# EAGLE design control-zenerbridge2 (EAGLE 6.6.0)
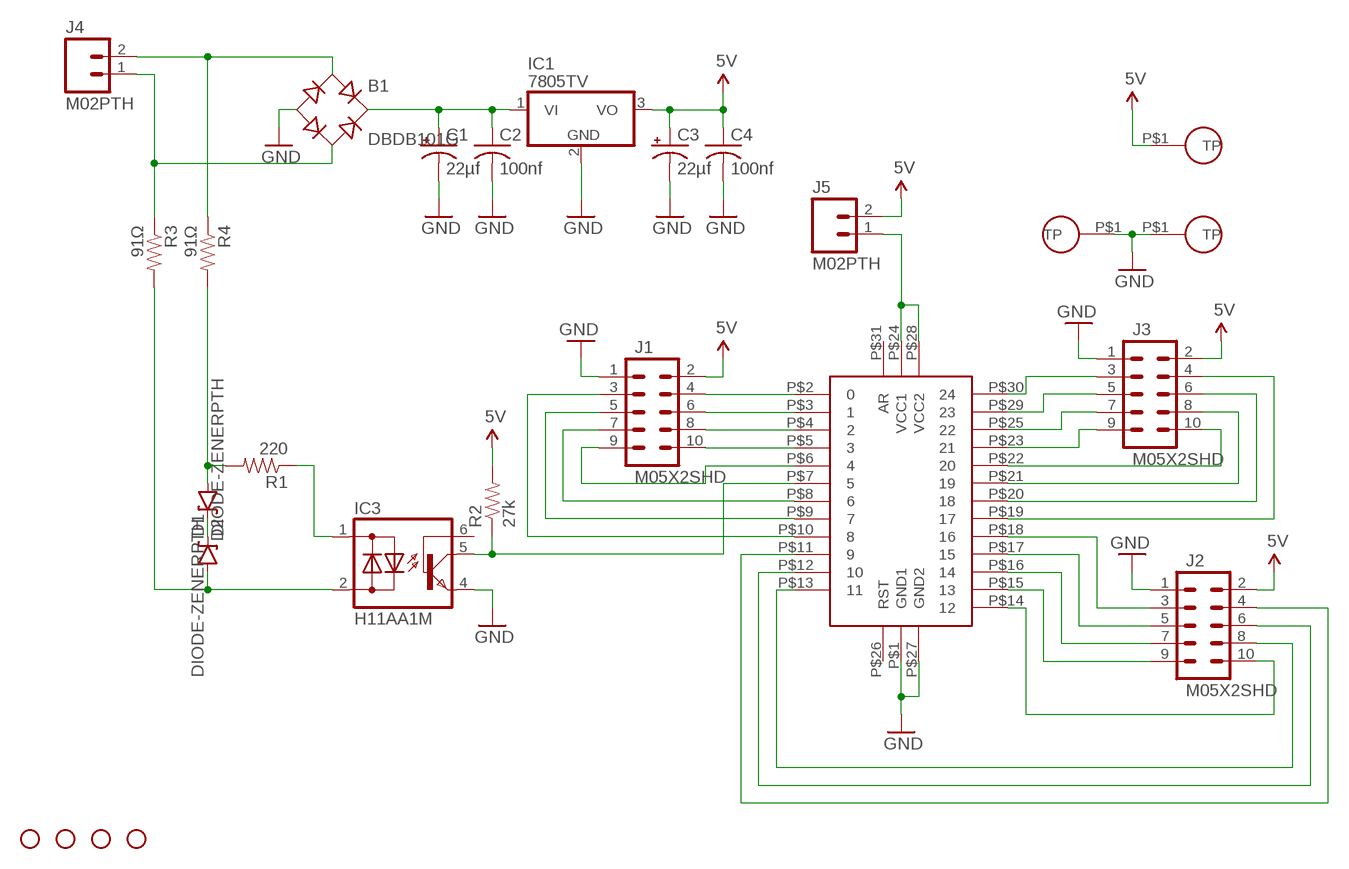
[diagram p0: schematic, sheet 1]

## Parts
B1  DBDB101G  [DB]
C1  22µf  CPOL-USE5-8.5  [E5-8,5]
C2  100nf  C-US025-030X050  [C025-030X050]
C3  22µf  CPOL-USE5-8.5  [E5-8,5]
C4  100nf  C-US025-030X050  [C025-030X050]
D1  DIODE-ZENERPTH  [DIODE-ZENER]
D2  DIODE-ZENERPTH  [DIODE-ZENER]
IC1  7805TV  [TO220V]
IC2  TEENSY2  [TEENSY2]
IC3  H11AA1M  [DIL06]
J1  M05X2SHD  [2X5-SHROUDED]
J2  M05X2SHD  [2X5-SHROUDED]
J3  M05X2SHD  [2X5-SHROUDED]
J4  M02PTH  [1X02]
J5  M02PTH  [1X02]
R1  220  RESISTORPTH-1/4W  [AXIAL-0.4]
R2  27k  RESISTORPTH-1/4W  [AXIAL-0.4]
R3  91Ω  RESISTORPTH-1/4W  [AXIAL-0.4]
R4  91Ω  RESISTORPTH-1/4W  [AXIAL-0.4]
STANDOFF1  STAND-OFF  [STAND-OFF]
STANDOFF2  STAND-OFF  [STAND-OFF]
STANDOFF3  STAND-OFF  [STAND-OFF]
STANDOFF4  STAND-OFF  [STAND-OFF]
U$3  TP  [TP]
U$8  TP  [TP]
U$9  TP  [TP]

## Nets
5V: C3.+ C4.1 IC1.3(VO) J1.2 J2.2 J3.2 J5.2 R2.P$2 U$8.P$1(TP)
GND: B1.- C1.- C2.2 C3.- C4.2 IC1.2(GND) IC2.P$1(GND1) IC2.P$27(GND2) IC3.4(E) J1.1 J2.1 J3.1 U$3.P$1(TP) U$9.P$1(TP)
N$1: D1.P$2(A) IC3.2(AC2) R3.P$2
N$2: B1.AC1 J4.2 R4.P$1
N$3: B1.+ C1.+ C2.1 IC1.1(VI)
N$4: IC2.P$21 J3.8
N$5: IC2.P$20 J3.6
N$6: IC2.P$2 J1.4
N$7: IC2.P$3 J1.6
N$8: IC2.P$7 IC3.5(C) R2.P$1
N$9: IC2.P$19 J3.4
N$10: IC2.P$18 J2.3
N$11: IC2.P$4 J1.8
N$12: IC2.P$5 J1.10
N$13: IC2.P$24(VCC1) IC2.P$28(VCC2) J5.1
N$14: B1.AC2 J4.1 R3.P$1
N$15: IC3.1(AC1) R1.P$1
N$16: IC2.P$6 J1.9
N$17: IC2.P$8 J1.7
N$18: D2.P$2(A) R1.P$2 R4.P$2
N$19: IC2.P$17 J2.5
N$20: IC2.P$16 J2.7
N$21: IC2.P$9 J1.5
N$22: IC2.P$10 J1.3
N$23: IC2.P$30 J3.3
N$24: IC2.P$15 J2.9
N$25: IC2.P$14 J2.10
N$26: IC2.P$29 J3.5
N$27: IC2.P$25 J3.7
N$28: IC2.P$23 J3.9
N$29: IC2.P$22 J3.10
N$30: IC2.P$13 J2.8
N$31: IC2.P$12 J2.6
N$32: IC2.P$11 J2.4
N$33: D1.P$1(C) D2.P$1(C)
Unconnected: IC2.P$26(RST) IC2.P$31(AR) IC3.6(B)

## Library data of the parts
B1 = rectifier:DB?*G: Single Phase 1.0 AMP Glass Passivated Bridge Rectifier Taiwan Semiconductor Co.,Ltd. - TSC Source: http://www.taiwansemi.com/TSCbig5/ezcatfiles/cust/img/img/db101g.pdf http://www.ts.com.tw/db/pictures/modules/PDT/PDT060207001/DBLS201G.pdf
C1 C3 = adafruit:CPOL-US: POLARIZED CAPACITOR, American symbol
C2 C4 = adafruit:C-US: CAPACITOR, American symbol
D1 D2 = SparkFun-DiscreteSemi:DIODE-ZENER: Zener Diode Production Part - 8199 3.4V Zener Voltage
IC1 = linear:78*: Positive VOLTAGE REGULATOR Source: http://cache.national.com/ds/LM/LM78L05.pdf http://www.fairchildsemi.com/ds/LM/LM7805.pdf
IC2 = bodger:TEENSY2
IC3 = bodger:H11AA1M: Fairchild optocoupler; MF: Fairchild; MPN: H11AA1M; OC_DIGIKEY: H11AA1M-ND
J1-J3 = bodger:M05X2: Header 5x2 Standard 10-pin dual row 0.1" header. Commonly used with AVR-ISP. Use with Spark Fun Electronics SKU: PRT-00778
J4 J5 = SparkFun-Connectors:M02: Standard 2-pin 0.1" header. Use with - straight break away headers ( PRT-00116) - right angle break away headers (PRT-00553) - swiss pins (PRT-00743) - machine pins (PRT-00117) - female headers (PRT-00115) Molex polarized connector foot print use with: PRT-08233 with associated crimp pins and housings. 2.54_SCREWTERM for use with PRT-10571. 3.5mm Screw Terminal footprints for PRT-08084 5mm Screw Terminal footprints for use with PRT-08433
R1-R4 = SparkFun-Passives:RESISTOR: Resistor Basic schematic elements and footprints for 0603, 1206, and PTH resistors.
STANDOFF1-STANDOFF4 = SparkFun-Electromechanical:STAND-OFF: #4 Stand Off This is the mechanical footprint for a #4 phillips button head screw. Use the keepout ring to avoid running the screw head into surrounding components. SKU : PRT-00447
U$3 U$8 U$9 = bodger:TP

## Board
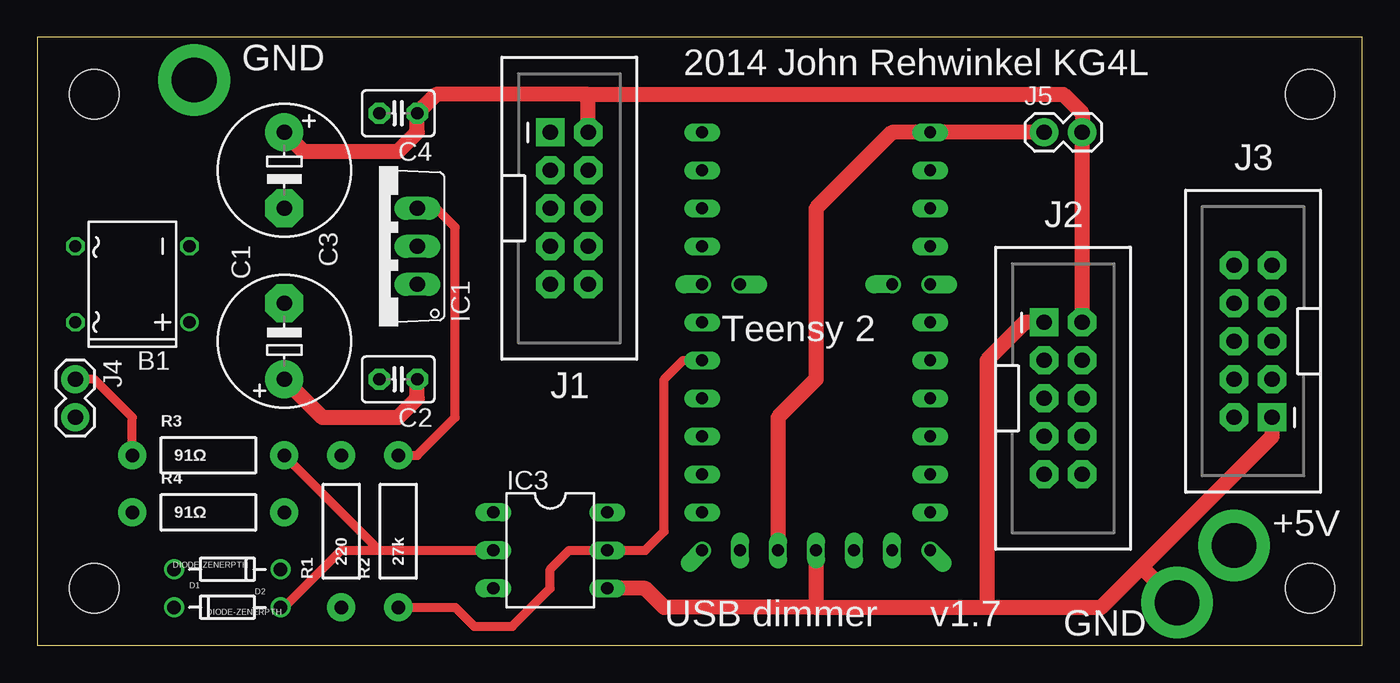
[diagram p1: board, top side]
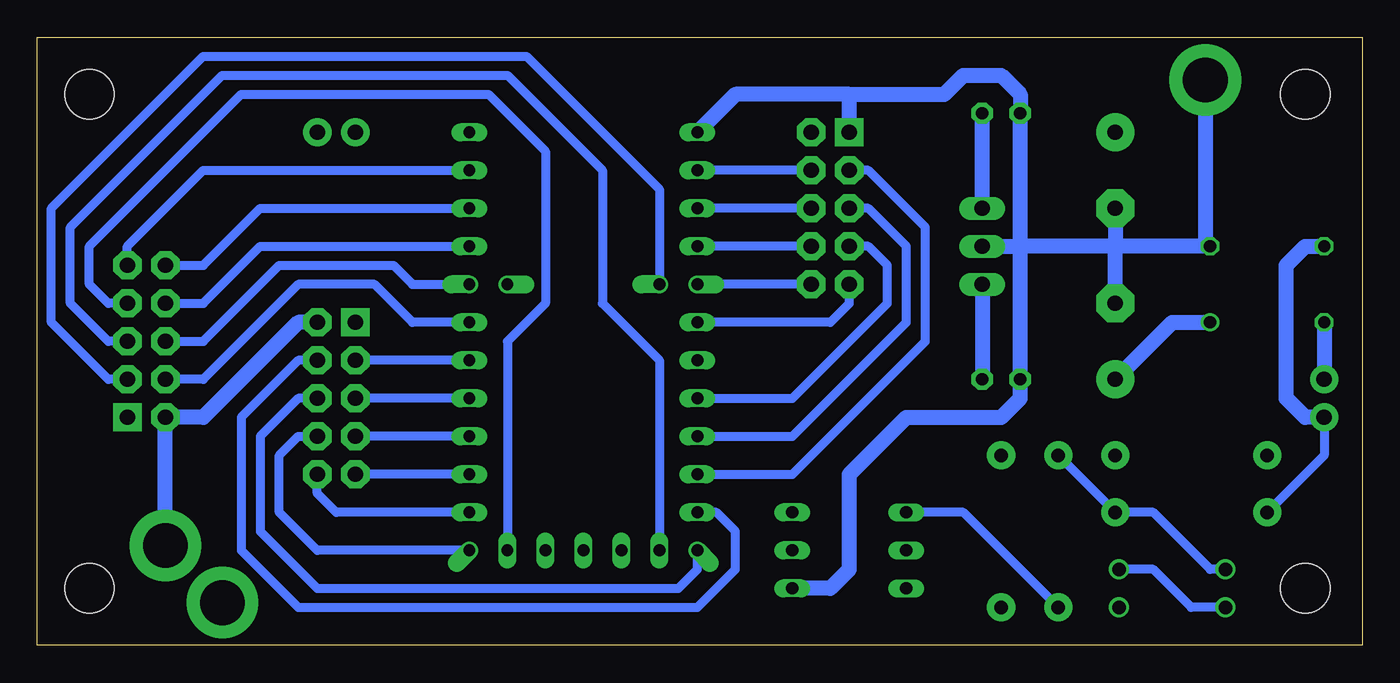
[diagram p2: board, bottom side, seen from below]

Size 88.57 x 40.63 mm. Coordinates in mm from the lower left corner, seen from the top.
Outline: 0,0 88.57,0 88.57,40.63 0,40.63 0,0
Copper layers (1*16): Top 0.0356mm / dielectric 1.5011mm / Bottom 0.0356mm
Design rules "LaenPCBOrder": minimum track width 6mil, minimum drill 13mil, track to track 6mil, track to pad 6mil, pad to pad 6mil, via to via 6mil, smd to smd 6mil, copper to edge 15mil, drill to drill 6mil, minimum pad ring 7mil, minimum via ring 7mil, stop-mask expansion 3mil, vias tented up to drill 0mil, thermal gap 10mil

### Footprints (pad centres in the part's own frame; a part is rotated, then mirrored left to right if it is on the bottom)
DB = drill 0.813: + -2.54,-3.81 | drill 0.813 octagon: - 2.54,-3.81; AC1 2.54,3.81; AC2 -2.54,3.81
E5-8,5 = drill 1.016 pad 2.54: + -2.54,0 | drill 1.016 pad 2.54 octagon: - 2.54,0
C025-030X050 = drill 0.813 pad 1.422 octagon: 1 -1.27,0; 2 1.27,0
DIODE-ZENER = drill 0.9: P$1 -3.556,0; P$2 3.556,0
TO220V = drill 1.016 long: 1 -2.54,-2.54; 2 0,-2.54; 3 2.54,-2.54
TEENSY2 = drill 0.8 long: P$1 -7.62,15.24; P$2 -7.62,12.7; P$3 -7.62,10.16; P$4 -7.62,7.62; P$6 -7.62,2.54; P$7 -7.62,0; P$8 -7.62,-2.54; P$9 -7.62,-5.08; P$10 -7.62,-7.62; P$11 -7.62,-10.16; P$14 7.62,-10.16; P$15 7.62,-7.62; P$16 7.62,-5.08; P$17 7.62,-2.54; P$18 7.62,0; P$19 7.62,2.54; P$21 7.62,7.62; P$22 7.62,10.16; P$23 7.62,12.7; P$24 7.62,15.24; P$25 5.08,-12.7; P$26 2.54,-12.7; P$27 0,-12.7; P$28 -2.54,-12.7; P$29 -5.08,-12.7 | drill 0.8 offset: P$5 -7.62,5.08; P$12 -7.62,-12.7; P$13 7.62,-12.7; P$20 7.62,5.08; P$30 -5.08,5.08; P$31 5.08,5.08
DIL06 = drill 0.813 long: 1 -2.54,-3.81; 2 0,-3.81; 3 2.54,-3.81; 4 2.54,3.81; 5 0,3.81; 6 -2.54,3.81
2X5-SHROUDED = drill 1.016 pad 1.88 square: 1 -1.27,5.08 | drill 1.016 pad 1.88 octagon: 2 1.27,5.08; 3 -1.27,2.54; 4 1.27,2.54; 5 -1.27,0; 6 1.27,0; 7 -1.27,-2.54; 8 1.27,-2.54; 9 -1.27,-5.08; 10 1.27,-5.08
1X02 = drill 1.016 pad 1.88: 1 0,0; 2 2.54,0
AXIAL-0.4 = drill 0.9 pad 1.88: P$1 -5.08,0; P$2 5.08,0
STAND-OFF = hole 3.302: 0,0
TP = drill 3 pad 4.8: P$1 0,0

### Placement (x,y rotation side)
B1  6.35,24.13 90 top
C1  16.51,20.32 90 top
C2  24.13,17.78 180 top
C3  16.51,31.75 270 top
C4  24.13,35.56 180 top
D1  12.7,2.54 0 top
D2  12.7,5.08 180 top
IC1  22.86,26.67 90 top
IC2  52.07,19.05 0 top
IC3  34.29,6.35 270 top
J1  35.56,29.21 0 top
J2  68.58,16.51 0 top
J3  81.28,20.32 180 top
J4  2.54,17.78 270 top
J5  67.31,34.29 0 top
R1  20.32,7.62 90 top
R2  24.13,7.62 90 top
R3  11.43,12.7 0 top
R4  11.43,8.89 0 top
STANDOFF1  3.81,3.81 0 top
STANDOFF2  3.81,36.83 0 top
STANDOFF3  85.09,36.83 0 top
STANDOFF4  85.09,3.81 352.2 top
U$3  76.2,2.86 0 top
U$8  80.01,6.67 0 top
U$9  10.48,37.78 0 top

### Tracks (layer width: path | path; a pad name or v marks a point on that pad's centre or on a via)
5V
  Top 0.61: R2.P$2 25.4,12.7 27.94,15.24 27.94,27.94 26.67,29.21 IC1.3
  Top 1.016: 36.83,36.83 68.58,36.83 69.85,35.56 J5.2 J2.2 | J1.2 36.83,36.83 | C3.+ 17.78,33.02 24.13,33.02 25.4,34.29 C4.1 26.67,36.83 36.83,36.83
  Bottom 1.016: IC1.3 C4.1 | J2.2 71.12,21.59 77.47,15.24 J3.2 U$8.P$1
GND
  Top 1.016: 73.66,5.08 71.12,2.54 63.5,2.54 | 73.66,5.08 82.55,13.97 J3.1 | J2.1 66.04,21.59 63.5,19.05 63.5,2.54 | 52.07,2.54 63.5,2.54 | IC2.P$27 52.07,2.54 | 52.07,2.54 41.91,2.54 40.64,3.81 IC3.4 | 73.66,5.08 73.98,5.08 U$3.P$1
  Bottom 1.016: 34.29,36.83 41.91,36.83 IC2.P$1 | J1.1 34.29,36.83 | 22.86,26.67 C2.2 22.86,16.51 24.13,15.24 30.48,15.24 34.29,11.43 34.29,5.08 35.56,3.81 IC3.4 | 22.86,26.67 C4.2 22.86,36.83 24.13,38.1 26.67,38.1 27.94,36.83 34.29,36.83 | IC1.2 22.86,26.67 | 16.51,26.67 B1.- 10.48,26.99 U$9.P$1 | 16.51,26.67 22.86,26.67 | C3.- 16.51,26.67 | C1.- 16.51,26.67
N$1
  Top 0.61: D1.P$2 16.51,2.54 20.32,6.35 22.86,6.35 | 22.86,6.35 IC3.2 | R3.P$2 22.86,6.35
N$2
  Bottom 0.61: J4.2 2.54,12.7 R4.P$1
  Bottom 1.016: J4.2 3.81,15.24 5.08,16.51 5.08,25.4 3.81,26.67 B1.AC1
N$3
  Top 1.016: C1.+ 19.05,15.24 24.13,15.24 25.4,16.51 C2.1
  Bottom 1.016: IC1.1 C2.1 | C1.+ 12.7,21.59 B1.+
N$4
  Bottom 0.61: J3.8 77.47,22.86 73.66,26.67 IC2.P$21
N$5
  Bottom 0.61: J3.6 77.47,20.32 72.39,25.4 64.77,25.4 63.5,24.13 IC2.P$20
N$6
  Bottom 0.61: J1.4 IC2.P$2
N$7
  Bottom 0.61: J1.6 IC2.P$3
N$8
  Top 0.61: IC2.P$7 43.18,19.05 41.91,17.78 41.91,7.62 40.64,6.35 IC3.5 35.56,6.35 34.29,5.08 34.29,3.81 31.75,1.27 29.21,1.27 27.94,2.54 R2.P$1
N$9
  Bottom 0.61: IC2.P$19 63.5,21.59 66.04,24.13 71.12,24.13 77.47,17.78 J3.4
N$10
  Bottom 0.61: IC2.P$18 J2.3
N$11
  Bottom 0.61: J1.8 IC2.P$4
N$12
  Bottom 0.61: J1.10 IC2.P$5
N$13
  Top 1.016: J5.1 IC2.P$24 57.15,34.29 52.07,29.21 52.07,17.78 49.53,15.24 IC2.P$28
N$14
  Top 0.61: R3.P$1 6.35,15.24 3.81,17.78 J4.1
  Bottom 1.016: B1.AC2 J4.1
N$15
  Bottom 0.61: R1.P$1 26.67,8.89 IC3.1
N$16
  Bottom 0.61: J1.9 34.29,22.86 35.56,21.59 IC2.P$6
N$17
  Bottom 0.61: IC2.P$8 38.1,16.51 31.75,22.86 31.75,25.4 33.02,26.67 J1.7
N$18
  Bottom 0.61: D2.P$2 10.16,5.08 13.97,8.89 R4.P$2 R1.P$2
N$19
  Bottom 0.61: IC2.P$17 J2.5
N$20
  Bottom 0.61: IC2.P$16 J2.7
N$21
  Bottom 0.61: IC2.P$9 38.1,13.97 30.48,21.59 30.48,26.67 33.02,29.21 J1.5
N$22
  Bottom 0.61: IC2.P$10 38.1,11.43 29.21,20.32 29.21,27.94 33.02,31.75 J1.3
N$23
  Bottom 0.61: J3.3 83.82,17.78 87.63,21.59 87.63,29.21 77.47,39.37 55.88,39.37 46.99,30.48 IC2.P$30
N$24
  Bottom 0.61: IC2.P$15 J2.9
N$25
  Bottom 0.61: IC2.P$14 68.58,8.89 69.85,10.16 J2.10
N$26
  Bottom 0.61: J3.5 83.82,20.32 86.36,22.86 86.36,27.94 76.2,38.1 57.15,38.1 50.8,31.75 50.8,22.86 46.99,19.05 IC2.P$29
N$27
  Bottom 0.61: J3.7 83.82,22.86 85.09,24.13 85.09,26.67 74.93,36.83 58.42,36.83 54.61,33.02 54.61,22.86 57.15,20.32 IC2.P$25
N$28
  Bottom 0.61: J3.9 82.55,26.67 77.47,31.75 IC2.P$23
N$29
  Bottom 0.61: J3.10 77.47,25.4 73.66,29.21 IC2.P$22
N$30
  Bottom 0.61: IC2.P$13 69.85,6.35 72.39,8.89 72.39,12.7 71.12,13.97 J2.8
N$31
  Bottom 0.61: J2.6 71.12,16.51 73.66,13.97 73.66,7.62 69.85,3.81 45.72,3.81 44.45,5.08 IC2.P$12
N$32
  Bottom 0.61: J2.4 71.12,19.05 74.93,15.24 74.93,6.35 71.12,2.54 44.45,2.54 41.91,5.08 41.91,7.62 43.18,8.89 IC2.P$11
N$33
  Bottom 0.61: D1.P$1 11.43,2.54 13.97,5.08 D2.P$1

### Text on the board
tPlace: GND | 2014 John Rehwinkel KG4L | J3 | J2 | Teensy 2 | J1 | +5V | USB dimmer | v1.7 | GND